# Altium schematic sheet VGA2NTSC v11.SchDoc
size B
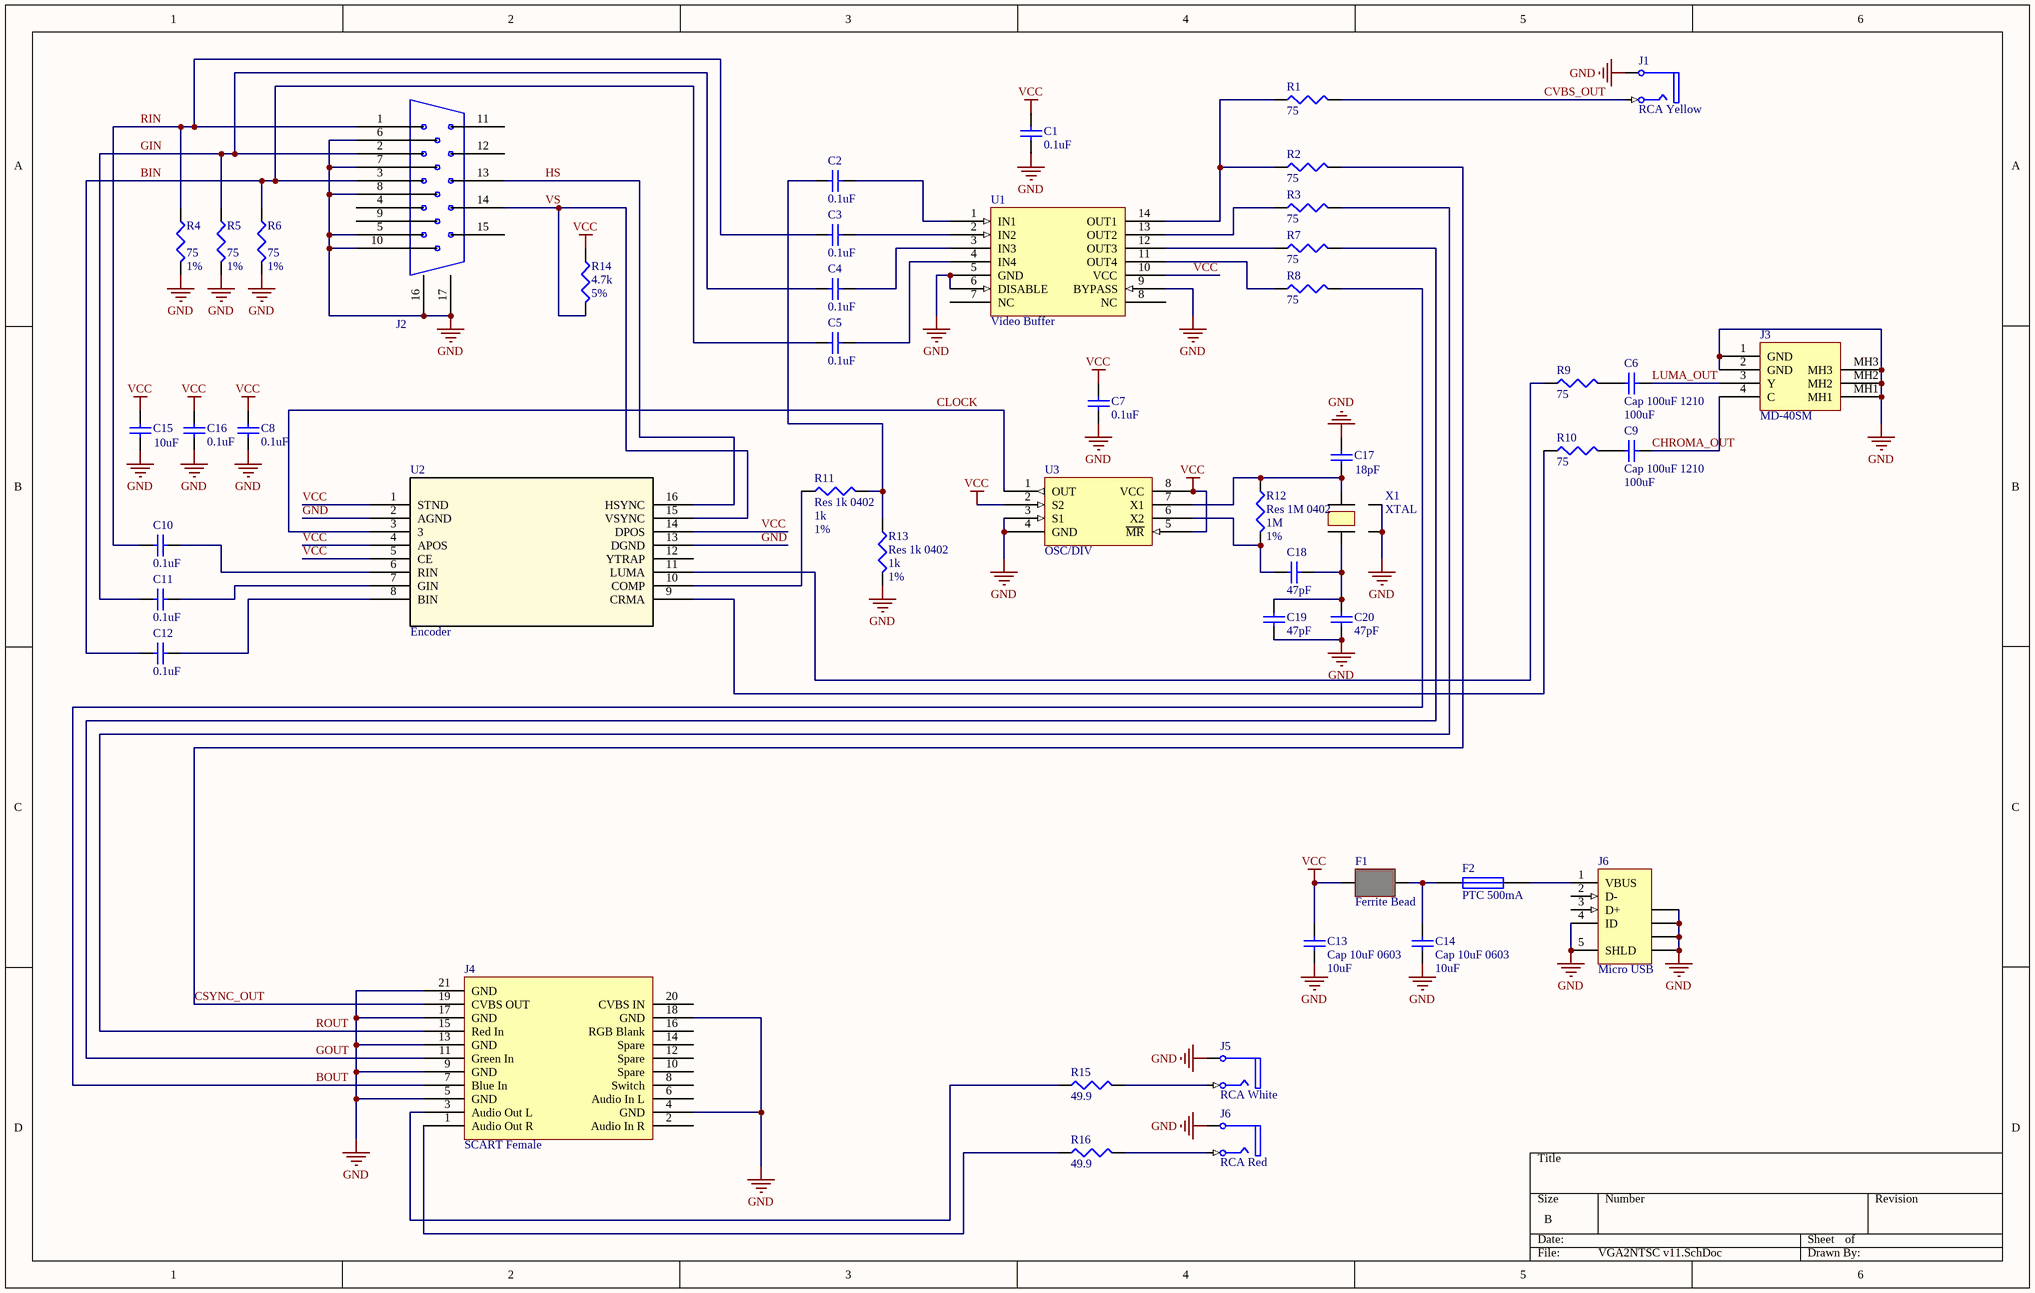
[diagram p0: VGA2NTSC v11.SchDoc]

## Parts
(Parts that share a designator on the sheet are numbered #1, #2 ... from top to bottom, then left to right.)
C1  value 0.1uF  [CAPC1005X05N]  (hidden comment: Cap 0.1uF 0402)
C2  value 0.1uF  [CAPC1005X05N]  (hidden comment: Cap 0.1uF 0402)
C3  value 0.1uF  [CAPC1005X05N]  (hidden comment: Cap 0.1uF 0402)
C4  value 0.1uF  [CAPC1005X05N]  (hidden comment: Cap 0.1uF 0402)
C5  value 0.1uF  [CAPC1005X05N]  (hidden comment: Cap 0.1uF 0402)
C6  Cap 100uF 1210  value 100uF  [CAPC3225X25N]
C7  value 0.1uF  [CAPC1005X05N]  (hidden comment: Cap 0.1uF 0402)
C8  value 0.1uF  [CAPC1005X05N]  (hidden comment: Cap 0.1uF 0402)
C9  Cap 100uF 1210  value 100uF  [CAPC3225X25N]
C10  value 0.1uF  [CAPC1005X05N]  (hidden comment: Cap 0.1uF 0402)
C11  value 0.1uF  [CAPC1005X05N]  (hidden comment: Cap 0.1uF 0402)
C12  value 0.1uF  [CAPC1005X05N]  (hidden comment: Cap 0.1uF 0402)
C13  Cap 10uF 0603  value 10uF  [CAPC1608X09N]
C14  Cap 10uF 0603  value 10uF  [CAPC1608X09N]
C15  value 10uF  [CAPC1608X09N]  (hidden comment: Cap 10uF 0603)
C16  value 0.1uF  [CAPC1005X05N]  (hidden comment: Cap 0.1uF 0402)
C17  value 18pF  [CAPC1005X05N]  (hidden comment: Cap 18pF 0402)
C18  value 47pF  [CAPC1005X05N]  (hidden comment: Cap 47pF 0402)
C19  value 47pF  [CAPC1005X05N]  (hidden comment: Cap 47pF 0402)
C20  value 47pF  [CAPC1005X05N]  (hidden comment: Cap 47pF 0402)
F1  Ferrite Bead  [CAPC1005X05N]
F2  PTC 500mA  [PTC1206]
J1  RCA Yellow  [RCJ-044]
J2  DB-15 VGA  [DB-15 VGA]  (value not drawn)
J3  MD-40SM  [CDIN2.6-3H4A]
J4  SCART Female  [SCART FEMALE]
J5  RCA White  [RCJ-043]
J6#1  Micro USB  [MICROUSB]
J6#2  RCA Red  [RCJ-042]
R1  value 75  [RESC1005X03N]  (hidden comment: Res 75 0402)
R2  value 75  [RESC1005X03N]  (hidden comment: Res 75 0402)
R3  value 75  [RESC1005X03N]  (hidden comment: Res 75 0402)
R4  value 75  Tolerance: 1%  [RESC1005X03N]  (hidden comment: Res 75 0402)
R5  value 75  Tolerance: 1%  [RESC1005X03N]  (hidden comment: Res 75 0402)
R6  value 75  Tolerance: 1%  [RESC1005X03N]  (hidden comment: Res 75 0402)
R7  value 75  [RESC1005X03N]  (hidden comment: Res 75 0402)
R8  value 75  [RESC1005X03N]  (hidden comment: Res 75 0402)
R9  value 75  [RESC1005X03N]  (hidden comment: Res 75 0402)
R10  value 75  [RESC1005X03N]  (hidden comment: Res 75 0402)
R11  Res 1k 0402  value 1k  Tolerance: 1%  [RESC1005X03N]
R12  Res 1M 0402  value 1M  Tolerance: 1%  [RESC1005X03N]
R13  Res 1k 0402  value 1k  Tolerance: 1%  [RESC1005X03N]
R14  value 4.7k  Tolerance: 5%  [RESC1005X03N]  (hidden comment: Res 4.7k)
R15  value 49.9  [RESC1005X03N]  (hidden comment: Res 49.9 0402)
R16  value 49.9  [RESC1005X03N]  (hidden comment: Res 49.9 0402)
U1  Video Buffer  [TSOP65P640X120-14N]
U2  Encoder  [SOIC127P1030X237-16N]
U3  OSC/DIV  [SOIC127P600X175_HS-8N]
X1  XTAL  [ABM8-28.63636MHZ-B2-T]

## Nets
GND: C1.1 C7.1 C8.1 C13.2 C14.2 C15.2 C16.1 C17.1 C19.1 C20.1 J1.1A(Ground) J2.5 J2.6 J2.7 J2.8 J2.10 J2.16 J2.17 J3.1(GND) J3.2(GND) J3.MH1 J3.MH2 J3.MH3 J4.4(GND) J4.5(GND) J4.9(GND) J4.13(GND) J4.17(GND) J4.18(GND) J4.21(GND) J5.1A(Ground) J6#1.4(ID) J6#1.5(SHLD) J6#1.6(SHLD) J6#1.7(SHLD) J6#1.8(SHLD) J6#1.9(SHLD) J6#2.1A(Ground) R4.2 R5.2 R6.2 R13.2 U1.5(GND) U1.6(DISABLE) U1.9(BYPASS) U2.2(AGND) U2.13(DGND) U3.3(S1) U3.4(GND) X1.2 X1.4
VCC: C1.2 C7.2 C8.2 C13.1 C15.1 C16.2 F1.1 R14.1 U1.10(VCC) U2.1(STND) U2.4(APOS) U2.5(CE) U2.14(DPOS) U3.2(S2) U3.5(~{MR}) U3.8(VCC)
BIN: C5.1 C12.1 J2.3 R6.1
BOUT: J4.7(Blue_In) R8.2
CHROMA_OUT: C9.2 J3.4(C)
CLOCK: U2.3 U3.1(OUT)
CSYNC_OUT: J4.19(CVBS_OUT) R2.2
CVBS_OUT: J1.2B(Signal) R1.2
GIN: C4.1 C11.1 J2.2 R5.1
GOUT: J4.11(Green_In) R7.2
HS: J2.13 U2.16(HSYNC)
LUMA_OUT: C6.2 J3.3(Y)
RIN: C3.1 C10.1 J2.1 R4.1
ROUT: J4.15(Red_In) R3.2
VS: J2.14 R14.2 U2.15(VSYNC)
NetC2_1: C2.1 R11.2 R13.1
NetC2_2: C2.2 U1.1(IN1)
NetC3_2: C3.2 U1.2(IN2)
NetC4_2: C4.2 U1.3(IN3)
NetC5_2: C5.2 U1.4(IN4)
NetC6_1: C6.1 R9.2
NetC9_1: C9.1 R10.2
NetC10_2: C10.2 U2.6(RIN)
NetC11_2: C11.2 U2.7(GIN)
NetC12_2: C12.2 U2.8(BIN)
NetC14_1: C14.1 F1.2 F2.1
NetC17_2: C17.2 R12.1 U3.7(X1) X1.3
NetC18_1: C18.1 R12.2 U3.6(X2)
NetC18_2: C18.2 C19.2 C20.2 X1.1
NetF2_2: F2.2 J6#1.1(VBUS)
NetJ4_1: J4.1(Audio_Out_R) R16.1
NetJ4_3: J4.3(Audio_Out_L) R15.1
NetJ5_2B: J5.2B(Signal) R15.2
NetJ6#2_2B: J6#2.2B(Signal) R16.2
NetR1_1: R1.1 R2.1 U1.14(OUT1)
NetR3_1: R3.1 U1.13(OUT2)
NetR7_1: R7.1 U1.12(OUT3)
NetR8_1: R8.1 U1.11(OUT4)
NetR9_1: R9.1 U2.11(LUMA)
NetR10_1: R10.1 U2.9(CRMA)
NetR11_1: R11.1 U2.10(COMP)

Not connected (* = marked no-connect by the designer): J2 4 9 11 12 15; J4 2(Audio_In_R) 6(Audio_In_L) 8(Switch) 10(Spare) 12(Spare) 14(Spare) 16(RGB_Blank) 20(CVBS_IN); J6#1 2(D-) 3(D+); U1 7(NC) 8(NC); U2 12(YTRAP)

## Library data of the parts
C1-C5 C7 C8 C10-C12 C16 = Cap 0.1uF 0402: Capacitor; ManufacturerPartNumber: CL05B104JO5NNNC; Dielectric: X7R; Voltage: 16V; DigiKey: 1276-1505-1-ND
C6 C9 = Cap 100uF 1210: Capacitor; ManufacturerPartNumber: GRM32ER61A107ME20L; Voltage: 10V; Dielectric: X5R; DigiKey: 490-9969-2-ND
C13-C15 = Cap 10uF 0603: Capacitor; ManufacturerPartNumber: GRM188R61A106KE69J; Voltage: 10V; Dielectric: X5R; DigiKey: 490-14372-2-ND
C17 = Cap 18pF 0402: Capacitor; ManufacturerPartNumber: CL05C180JB5NNNC; Dielectric: C0G; Voltage: 50V; DigiKey: 1276-1140-1-ND
C18-C20 = Cap 47pF: Capacitor; ManufacturerPartNumber: C0402C470K5GACTU; Dielectric: C0G; Voltage: 50V; DigiKey: 399-7796-2-ND
F1 = BLM15PX221SN1D: Ferrite Bead 220 Ohm 100Mhz 100mOhm DC; DigiKey: 490-11021-6-ND; ManufacturerPartNumber: BLM15PX221SN1D
F2 = PTC Fuse: PTC Fuse 500mA; ManufacturerPartNumber: 0ZCJ0050AF2E; DigiKey: 507-1803-1-ND
J1 = RCJ-044: RCA Jack Yellow; ManufacturerPartNumber: RCJ-044; DigiKey: CP-1421-ND
J2 = DB-15 VGA: ManufacturerPartNumber: ICD15S13E4GX00LF; DigiKey: 609-5181-ND
J3 = MD-40SM: DIN-4 S-Video Jack; DigiKey: CP-2240-ND; ManufacturerPartNumber: MD-40SM
J4 = SCART
J5 = RCJ-043: RCA Jack White; ManufacturerPartNumber: RCJ-043; DigiKey: CP-1420-ND
J6#1 = MICROUSB: ManufacturerPartNumber: 10118194-0001LF; DigiKey: 609-4618-1-ND
J6#2 = RCJ-042: RCA Jack Red; ManufacturerPartNumber: RCJ-042; DigiKey: CP-1419-ND
R1-R3 R7-R10 = Res 75 0402: Resistor 75 0402; ManufacturerPartNumber: RC0402FR-0775RL; Tolerance: 1%; DigiKey: 311-75.0LRTR-ND
R4-R6 = Res 75 0402: Resistor 75 0402; ManufacturerPartNumber: RC0402FR-0775RL; DigiKey: 311-75.0LRTR-ND
R11 R13 = Res 1k 0402: Resistor 1k 0402; ManufacturerPartNumber: RC1005F102CS; DigiKey: 1276-3430-1-ND
R12 = Res 1M 0402: Resistor 1M 0402; ManufacturerPartNumber: RC1005F105CS; DigiKey: 1276-3433-1-ND
R14 = Res 4.7k 0402: Resistor 4.7k 0402; ManufacturerPartNumber: RCS1005J472CS; DigiKey: 1276-7028-1-ND
R15 R16 = Res 49.9 0402: Resistor 49.9 0402; ManufacturerPartNumber: RC1005F49R9CS; Tolerance: 1%; DigiKey: 1276-3469-1-ND
U1 = TSH7373: ManufacturerPartNumber: THS7373IPWR; DigiKey: 296-25626-2-ND
U2 = AD725ARZ: RGB to Video Encoder; DigiKey: AD725ARZ-ND; ManufacturerPartNumber: AD725ARZ
U3 = 74HC6323AD: Counter + Oscillator; MFG: 74HC6323AD,112; DigiKey: 1727-3330-ND
X1 = ABM8-28.63636MHZ-B2-T: CRYSTAL 28.63636MHZ 18PF SMD; ManufacturerPartNumber: ABM8-28.63636MHZ-B2-T; DigiKey: 535-9143-2-ND